# EAGLE design iqrfsim (EAGLE 7.5.0)
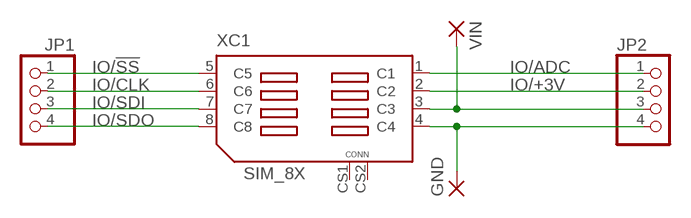
[diagram p0: schematic, sheet 1]

## Parts
GND  1,6/0,9  [1,6/0,9]
JP1  PINHD-1X4  [1X04]
JP2  PINHD-1X4  [1X04]
VIN  1,6/0,9  [1,6/0,9]
XC1  SIM_8X  [SIM_8XPADS]

## Nets
GND: GND.1(P) JP2.4 XC1.4(C4)
IO/!SS: JP1.1 XC1.5(C5)
IO/+3V: JP2.2 XC1.2(C2)
IO/ADC: JP2.1 XC1.1(C1)
IO/CLK: JP1.2 XC1.6(C6)
IO/SDI: JP1.3 XC1.7(C7)
IO/SDO: JP1.4 XC1.8(C8)
VIN: JP2.3 VIN.1(P) XC1.3(C3)
Unconnected: XC1.CS1 XC1.CS2

## Library data of the parts
GND VIN = wirepad:1,6/0,9: THROUGH-HOLE PAD
JP1 JP2 = pinhead:PINHD-1X4: PIN HEADER
XC1 = usbpiclib:SIM_8X

## Board
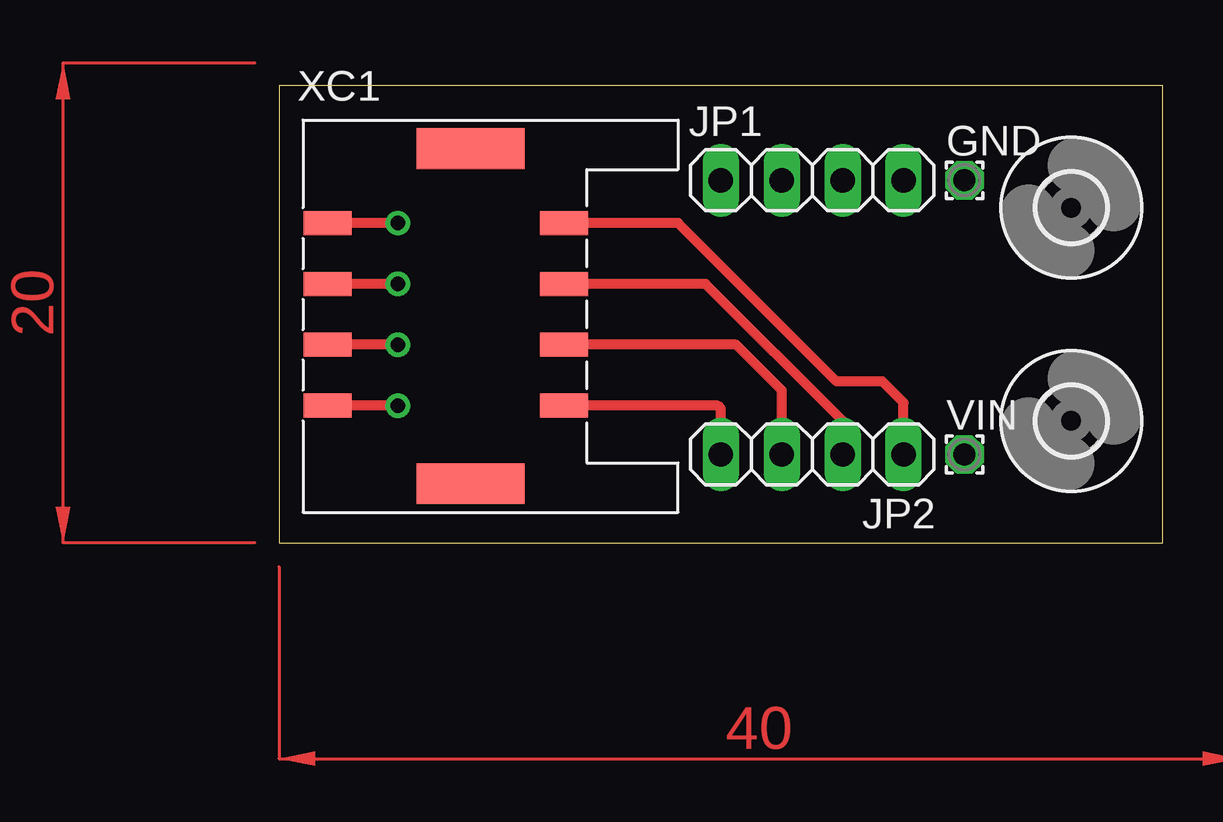
[diagram p1: board, top side]
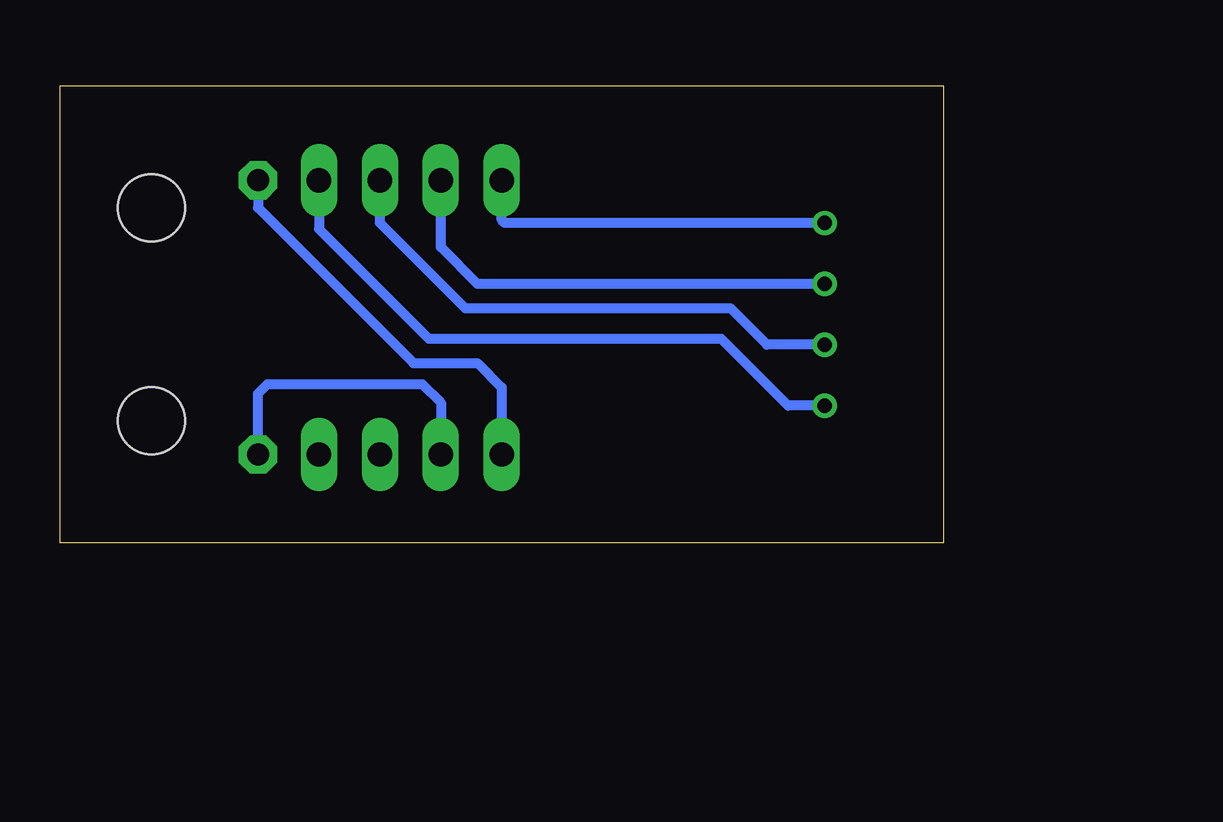
[diagram p2: board, bottom side, seen from below]

Size 36.83 x 19.05 mm. Coordinates in mm from the lower left corner, seen from the top.
Outline: 0,0 36.83,0 36.83,19.05 0,19.05 0,0
Copper layers (1*16): Top 0.035mm / dielectric 1.5mm / Bottom 0.035mm
Design rules "default": minimum track width 10mil, minimum drill 24mil, track to track 8mil, track to pad 8mil, pad to pad 8mil, via to via 8mil, smd to smd 8mil, copper to edge 40mil, drill to drill 8mil, minimum pad ring 10mil, minimum via ring 8mil, stop-mask expansion 4mil, vias tented up to drill 0mil, thermal gap 10mil

### Footprints (pad centres in the part's own frame; a part is rotated, then mirrored left to right if it is on the bottom)
1,6/0,9 = drill 0.914 pad 1.6 octagon: 1 0,0
1X04 = drill 1.016 long: 1 -3.81,0; 2 -1.27,0; 3 1.27,0; 4 3.81,0
2,8 = hole 2.8: 0,0
SIM_8XPADS = smd 2 x 1: 1 9.842,0; 2 9.842,-2.54; 3 9.842,-5.08; 4 9.842,-7.62; 5 0,0; 6 0,-2.54; 7 0,-5.08; 8 0,-7.62 | smd 4.5 x 1.7: CS1 5.953,3.096; CS2 5.953,-10.874

### Placement (x,y rotation side)
GND  28.57,15.11 0 top
JP1  22.23,15.11 0 top
JP2  22.23,3.68 180 top
U$1  [2,8]  33.02,13.97 0 top
U$2  [2,8]  33.02,5.08 0 top
VIN  28.57,3.68 0 top
XC1  2.03,13.34 0 top

### Tracks (layer width: path | path; a pad name or v marks a point on that pad's centre or on a via)
GND
  Top 0.406: JP2.4 18.41,5.59 18.29,5.71 XC1.4
  Bottom 0.406: GND.1 28.57,13.97 22.1,7.49 19.43,7.49 18.41,6.48 JP2.4
IO/!SS  (via drill 0.6)
  Top 0.406: v4.95,13.34 XC1.5
  Bottom 0.406: JP1.1 18.41,13.46 18.29,13.34 v4.95,13.34
IO/+3V
  Top 0.406: XC1.2 17.78,10.79 23.5,5.08 JP2.2
IO/ADC
  Top 0.406: XC1.1 16.64,13.34 23.24,6.73 25.15,6.73 26.04,5.84 JP2.1
IO/CLK  (via drill 0.6)
  Top 0.406: v4.95,10.79 XC1.6
  Bottom 0.406: JP1.2 20.95,12.32 19.43,10.79 v4.95,10.79
IO/SDI  (via drill 0.6)
  Top 0.406: v4.95,8.26 XC1.7
  Bottom 0.406: JP1.3 23.5,13.34 19.94,9.78 8.89,9.78 7.37,8.26 v4.95,8.26
IO/SDO  (via drill 0.6)
  Top 0.406: v4.95,5.71 XC1.8
  Bottom 0.406: JP1.4 26.04,13.08 21.46,8.51 9.27,8.51 6.48,5.71 v4.95,5.71
VIN
  Top 0.406: JP2.3 20.95,6.35 19.05,8.26 XC1.3
  Bottom 0.406: JP2.3 20.95,5.84 21.72,6.6 28.19,6.6 28.57,6.22 VIN.1
(copper drawn outside any net)
  shapes: Top area x2

### Text on the board
tDocu: IO/!SS | IO/SDI | IO/CLK | IO/SDO | GND | VIN | GND | IO/+3V | VIN | IO/ADC